# Altium schematic sheet out_role.SchDoc
size A0
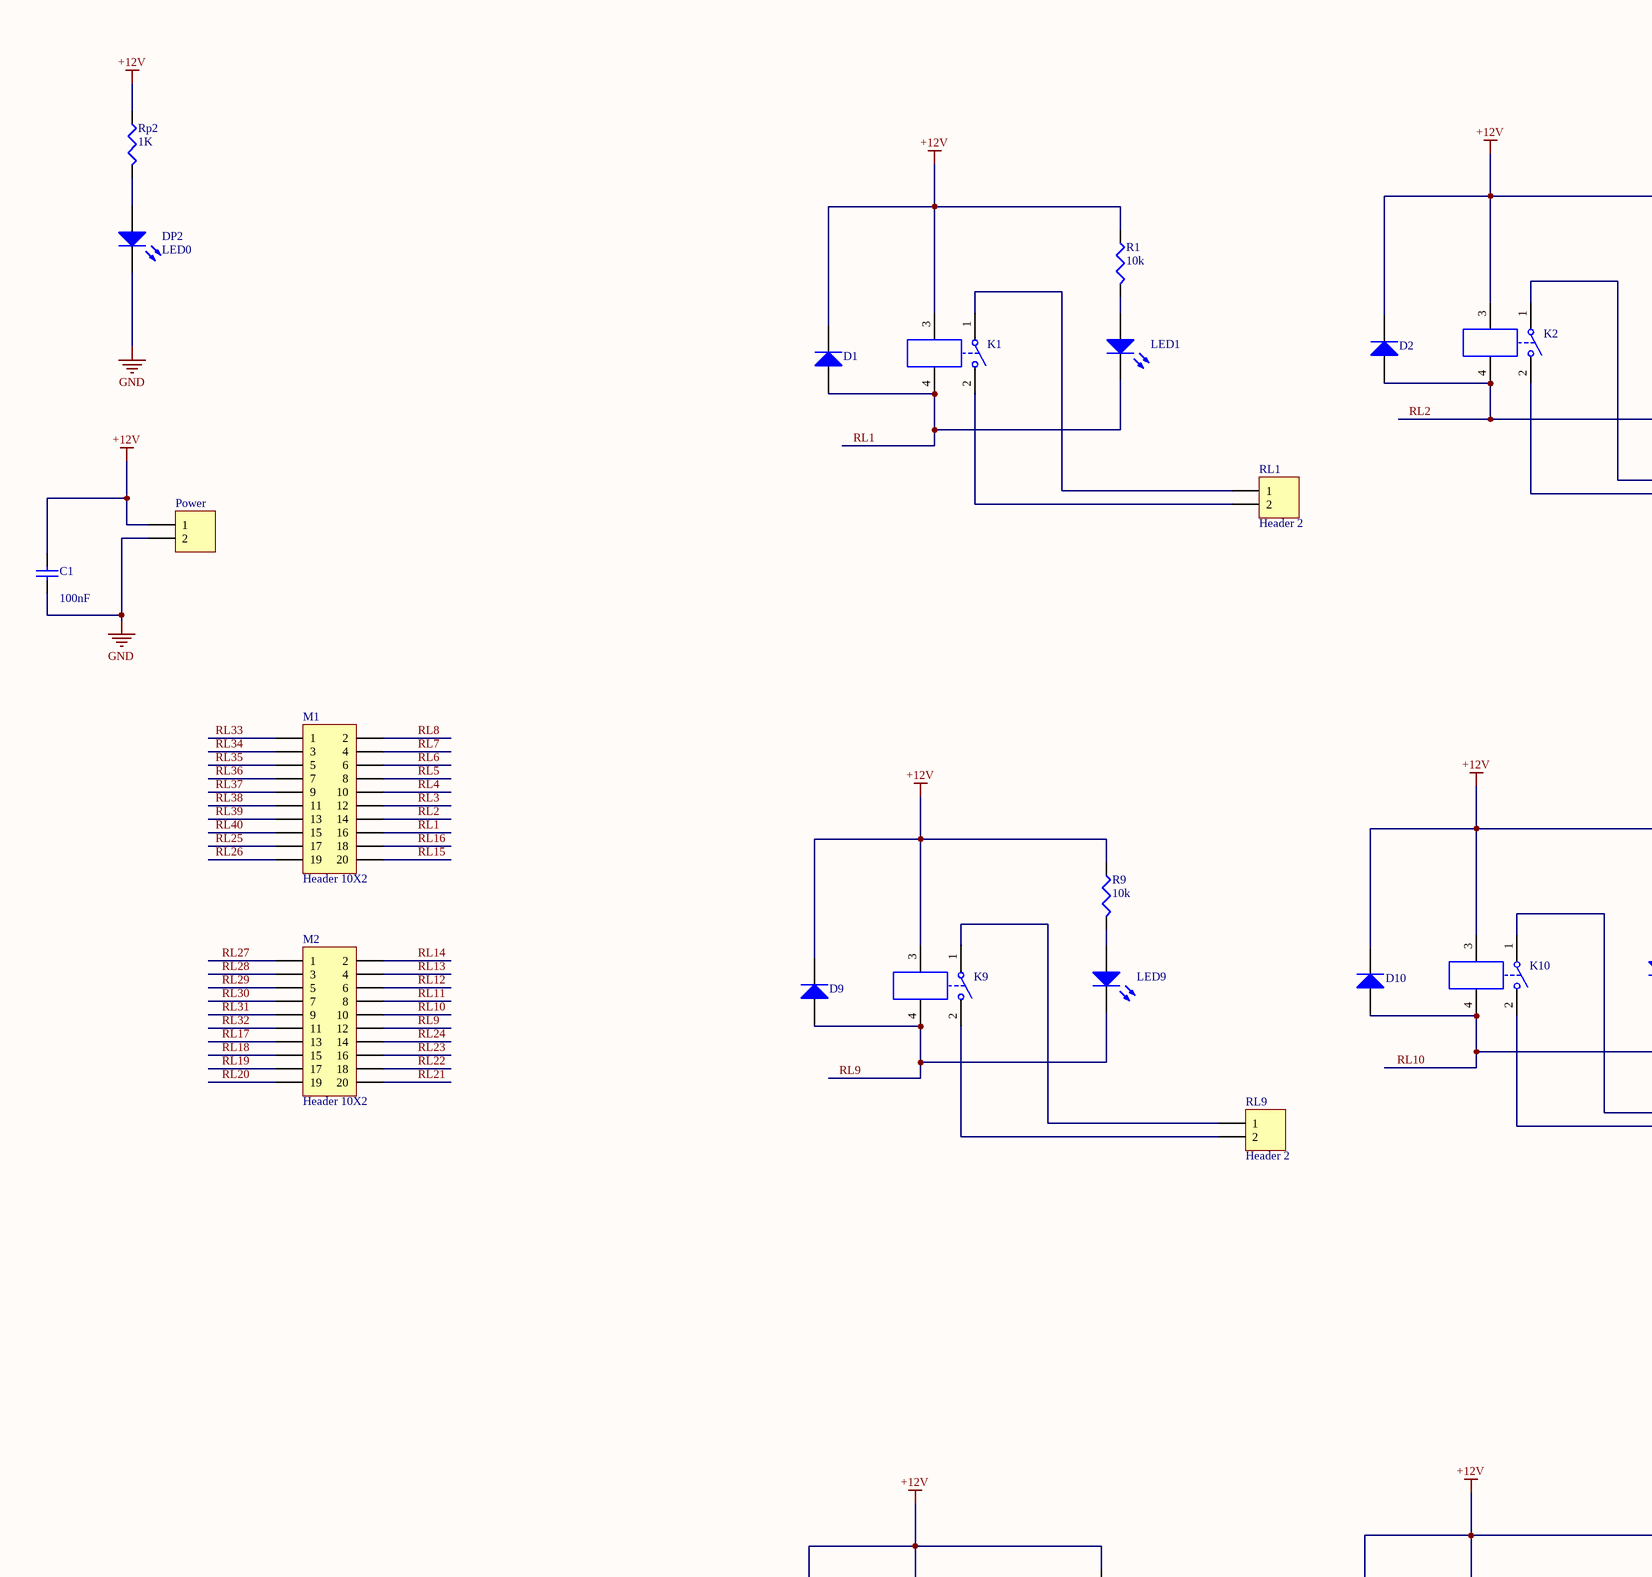
[diagram p0: out_role.SchDoc, top left]
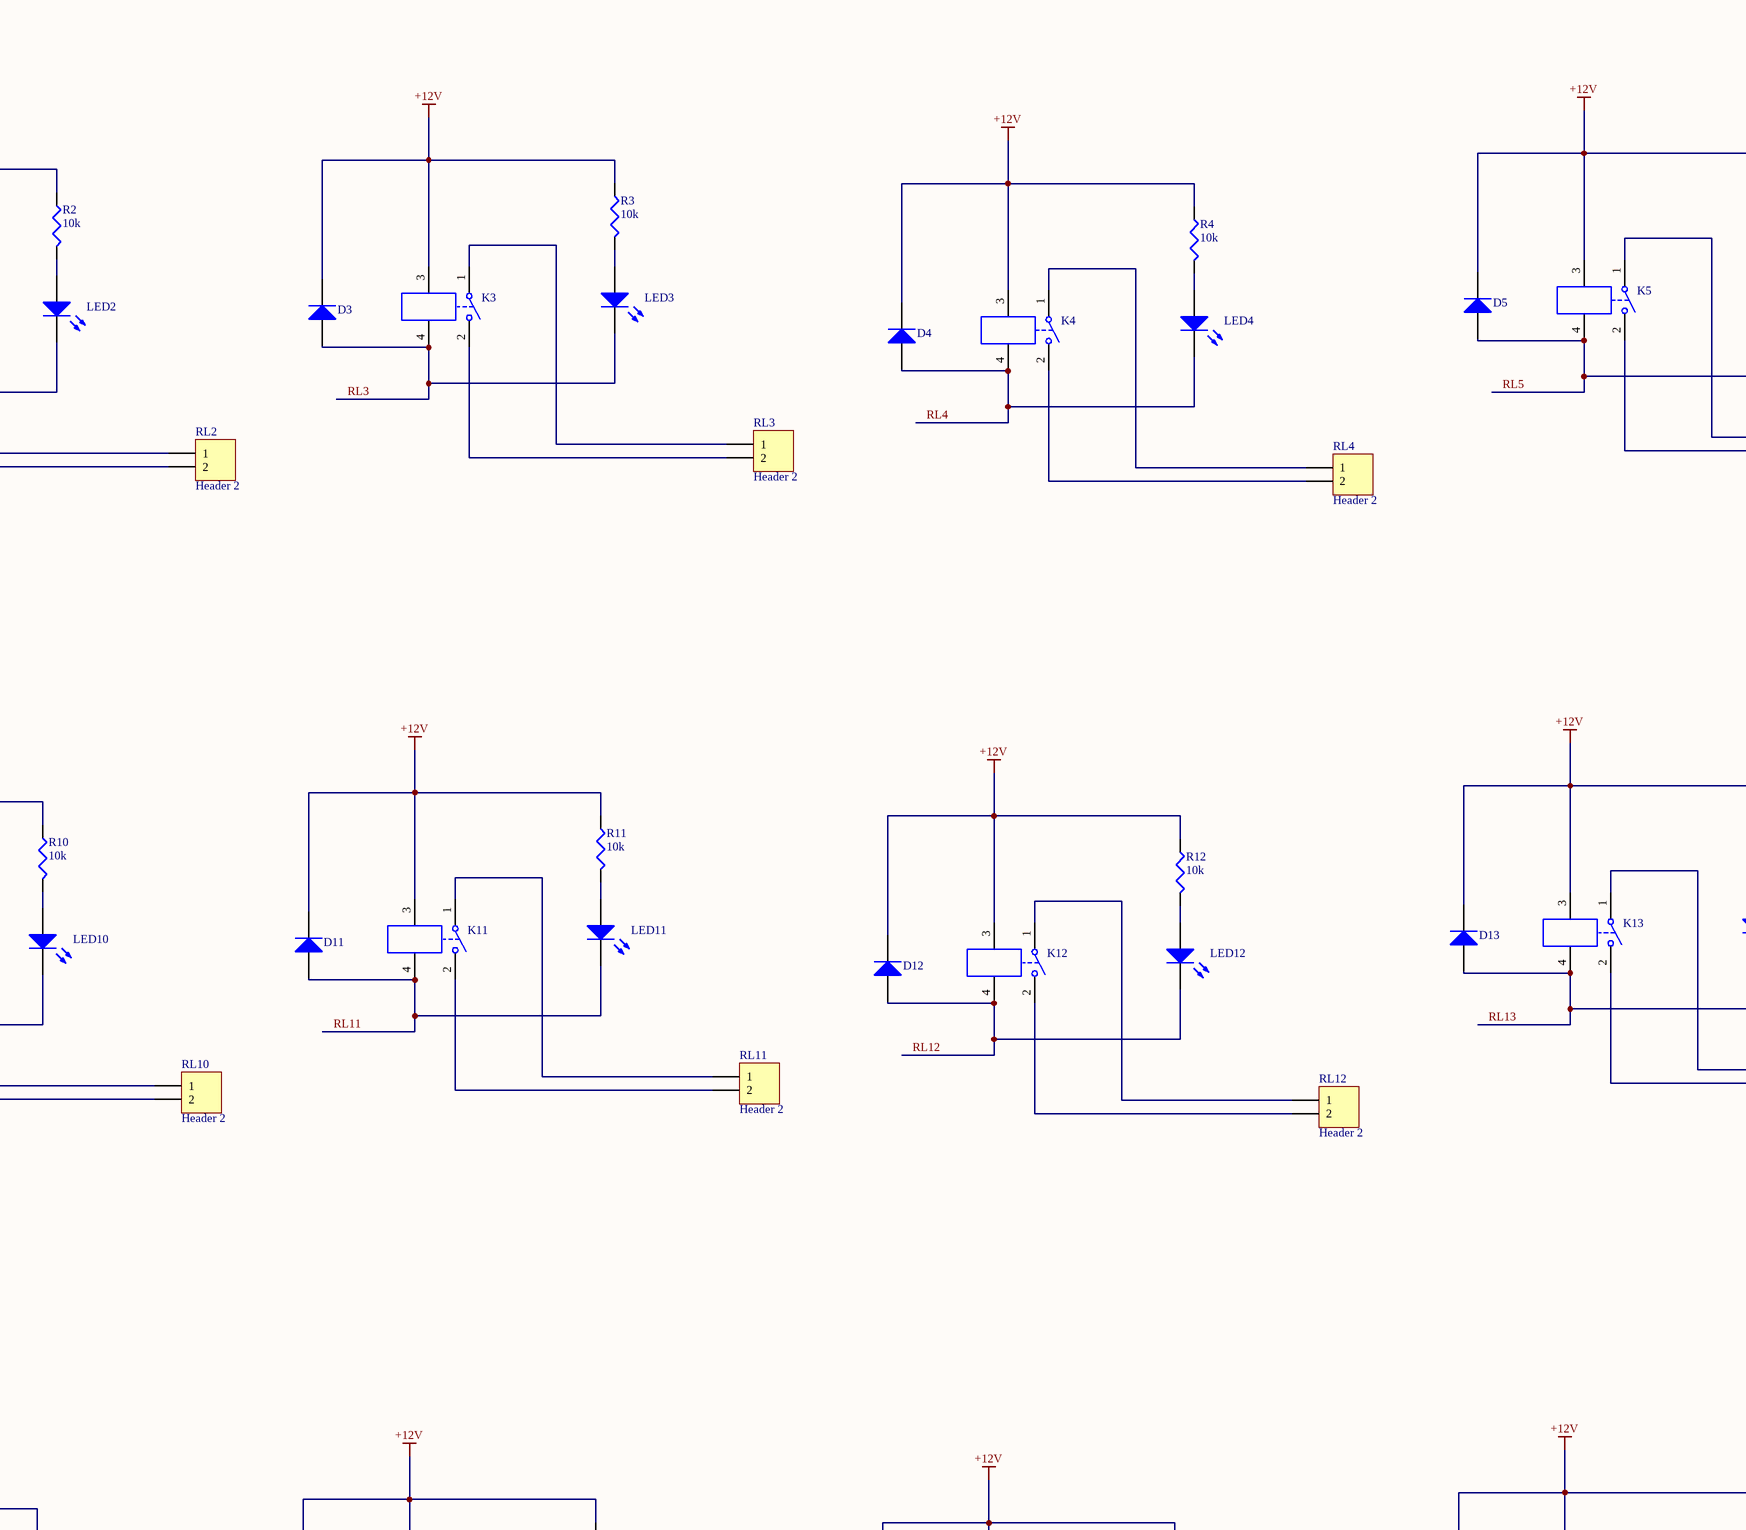
[diagram p1: out_role.SchDoc, top middle]
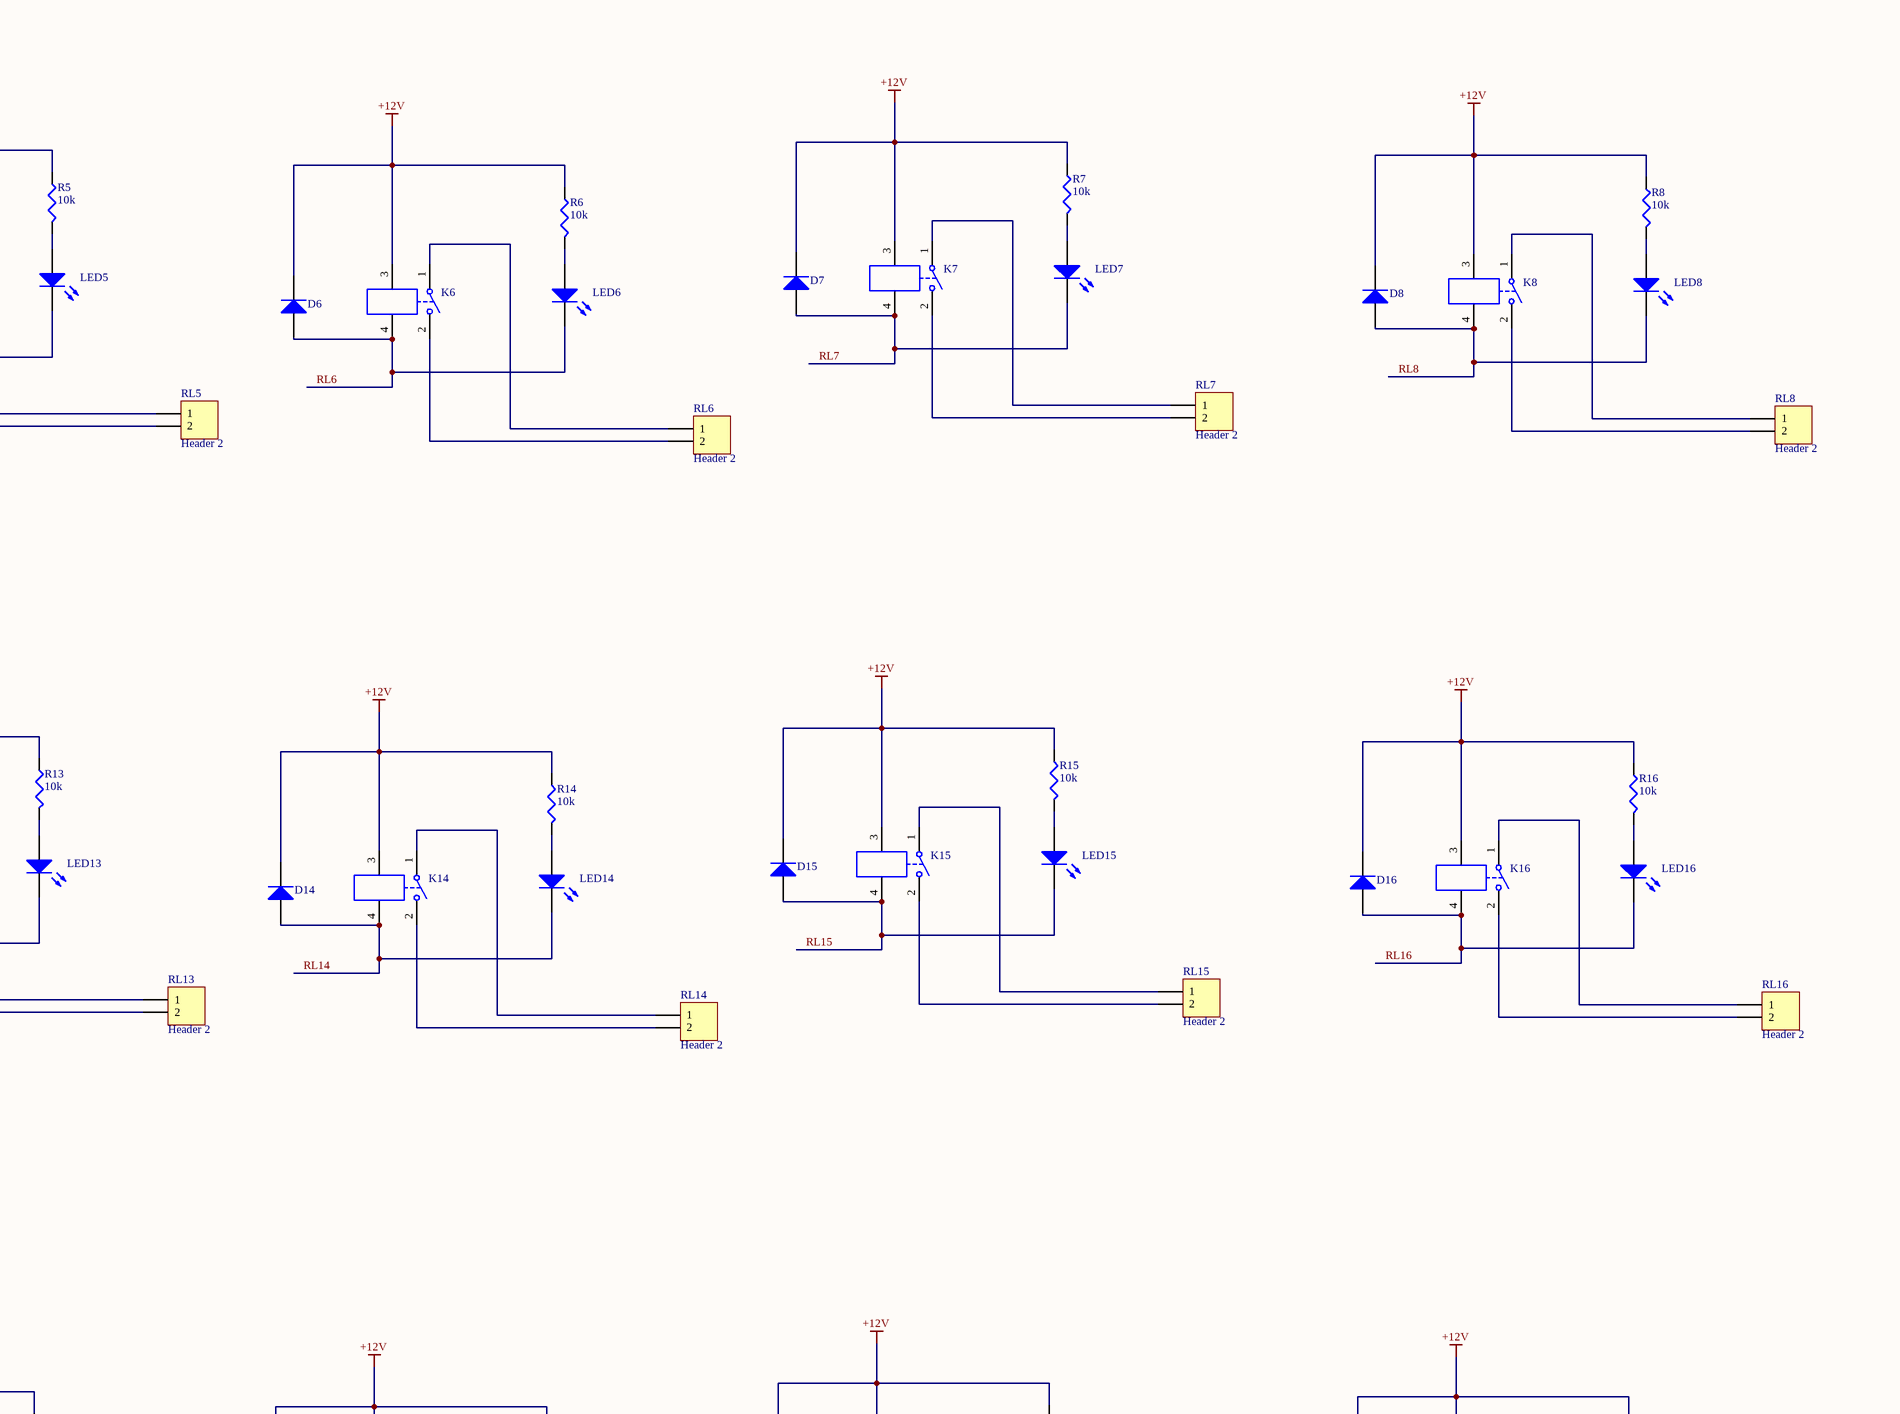
[diagram p2: out_role.SchDoc, top right]
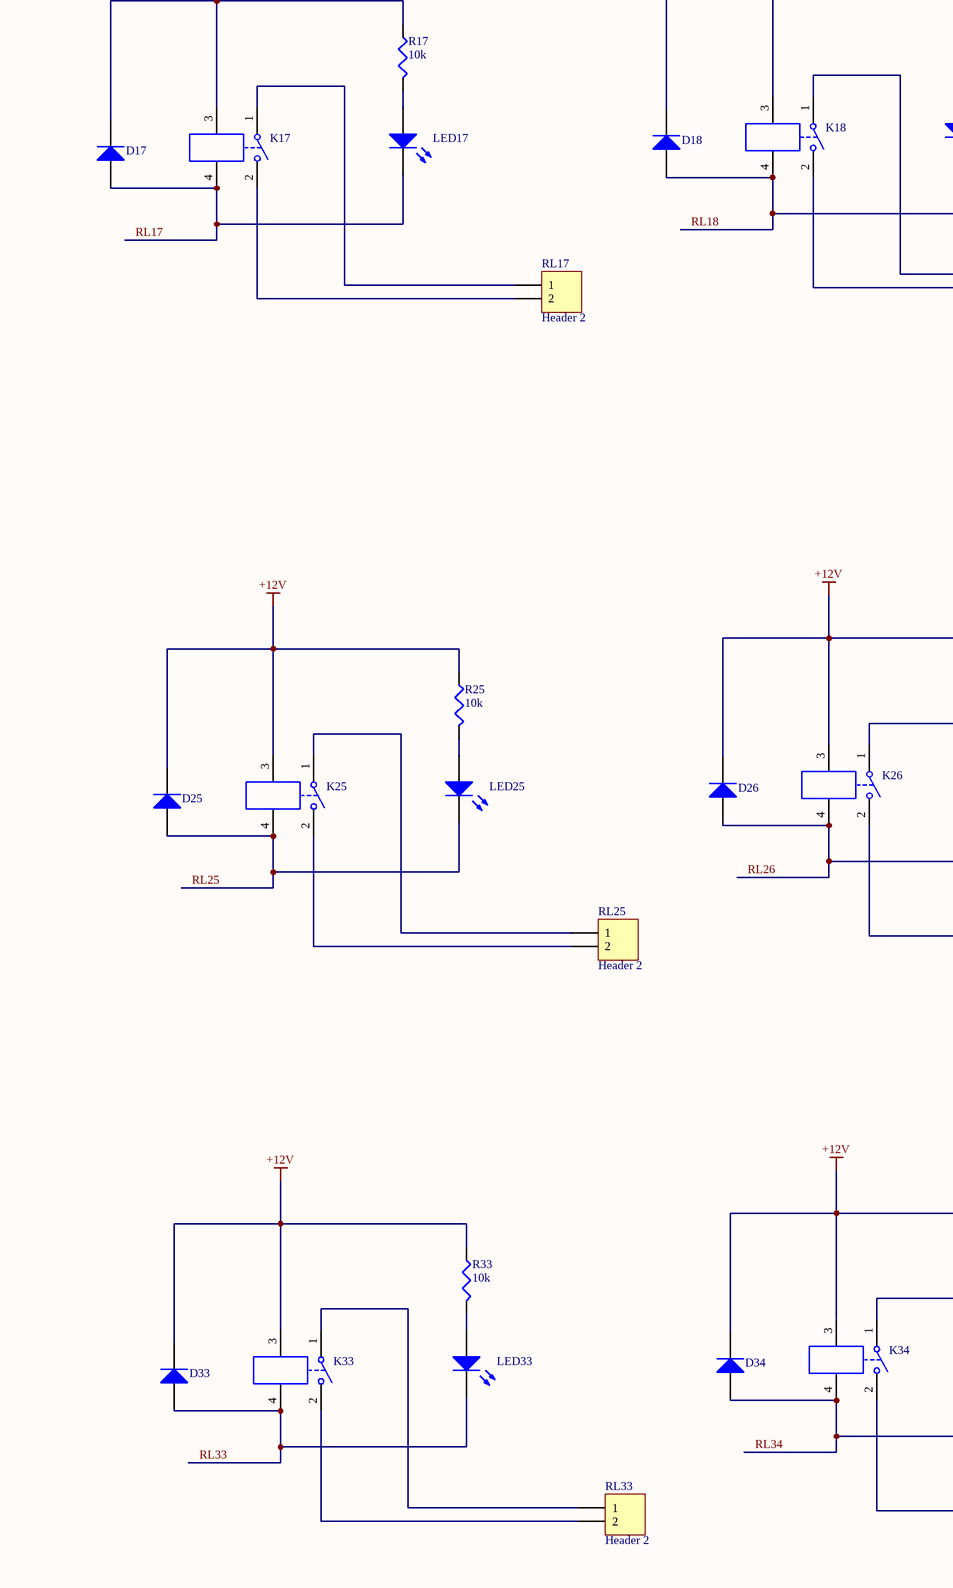
[diagram p3: out_role.SchDoc, bottom left]
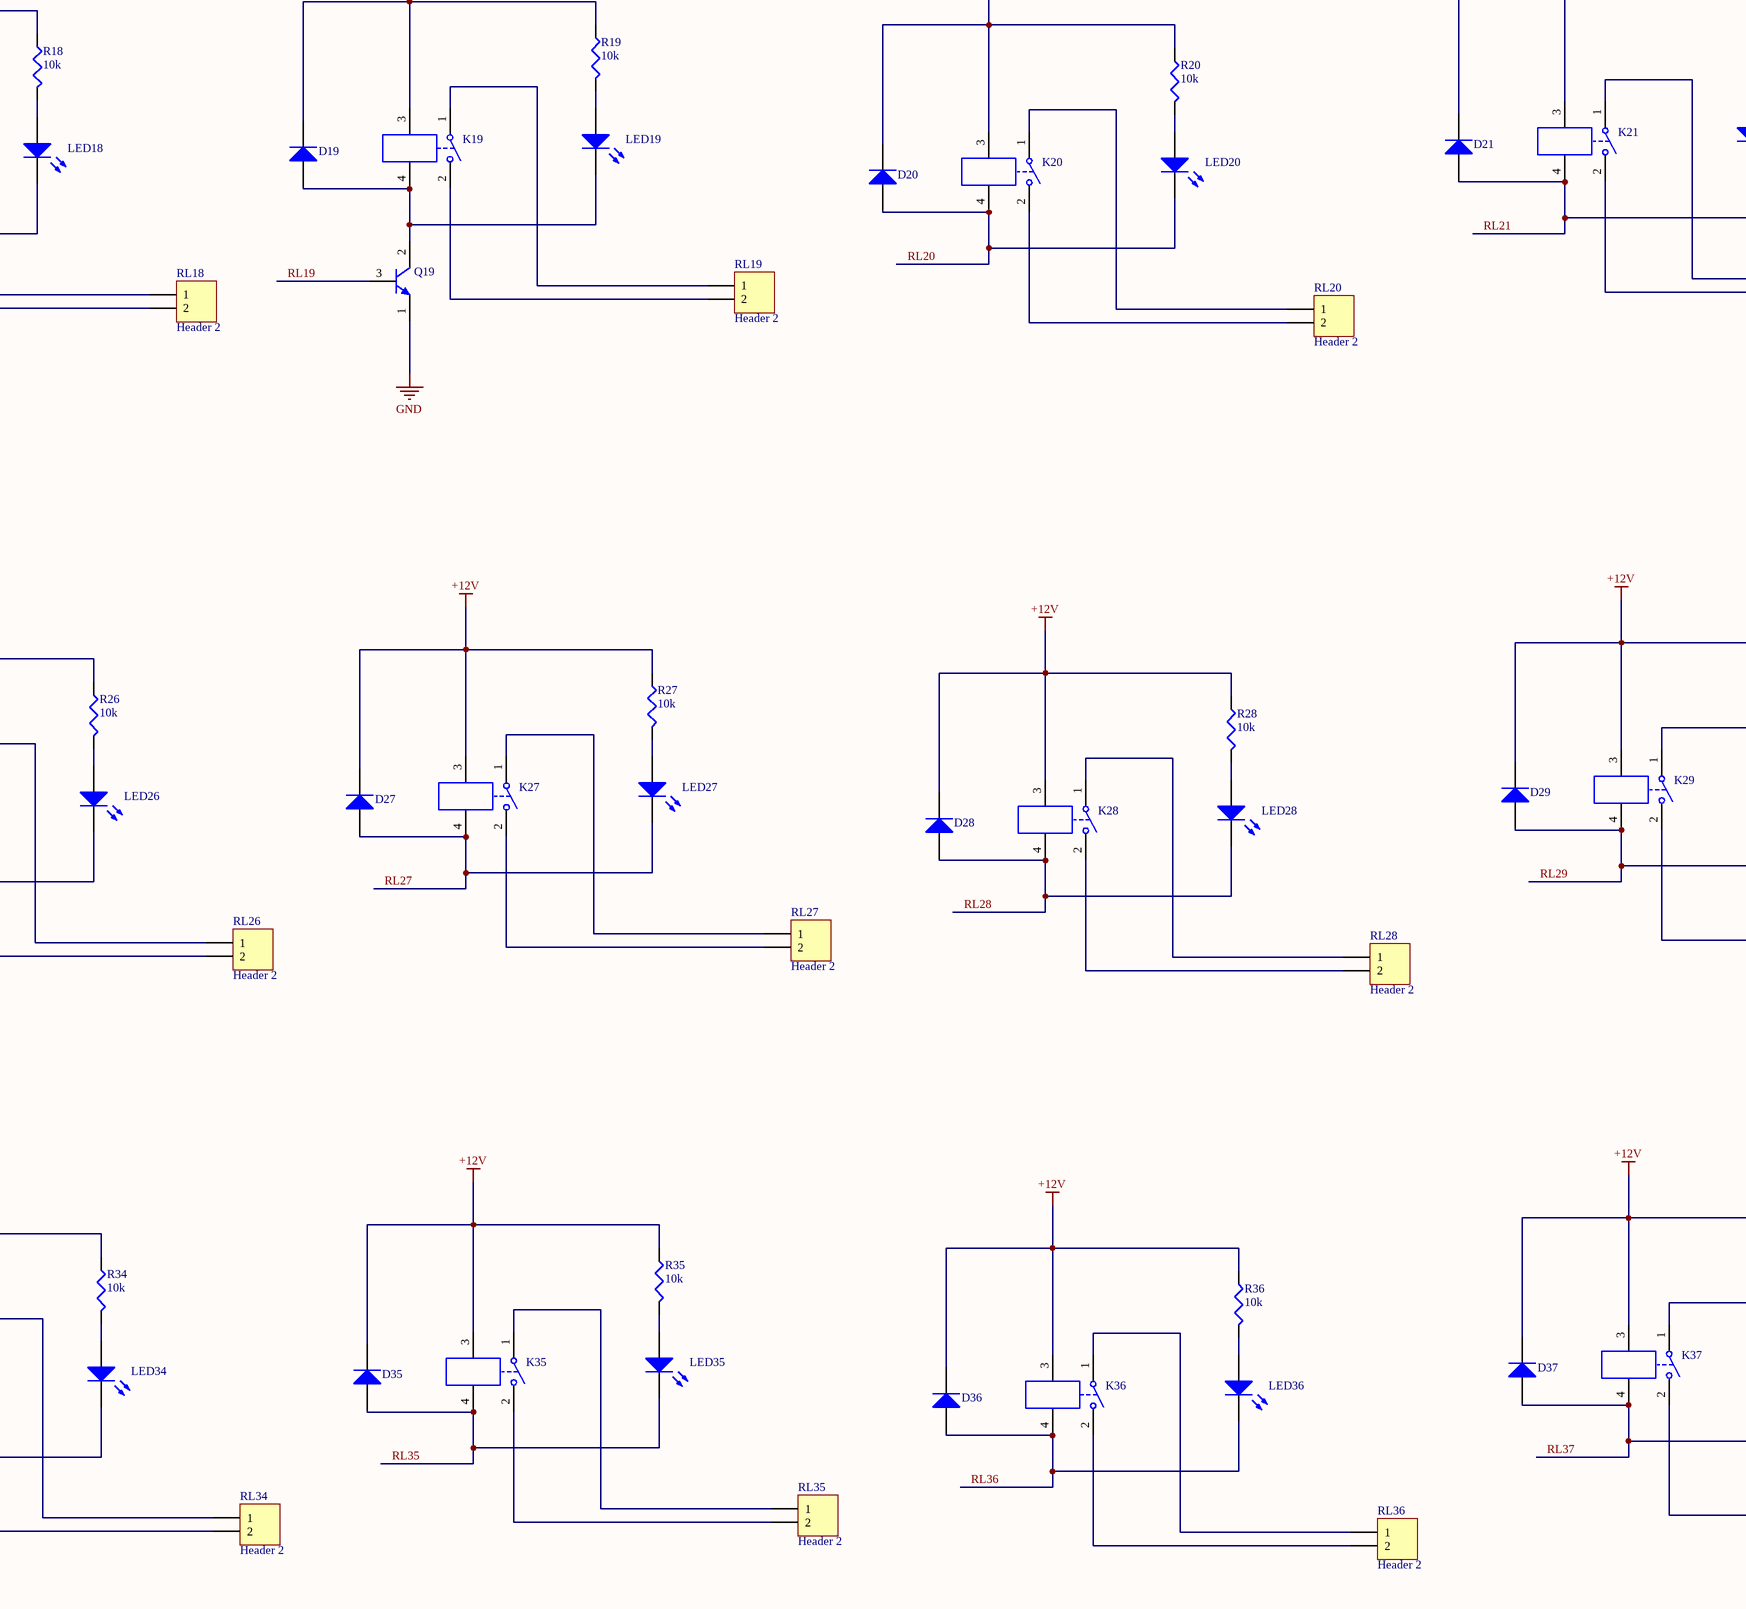
[diagram p4: out_role.SchDoc, bottom middle]
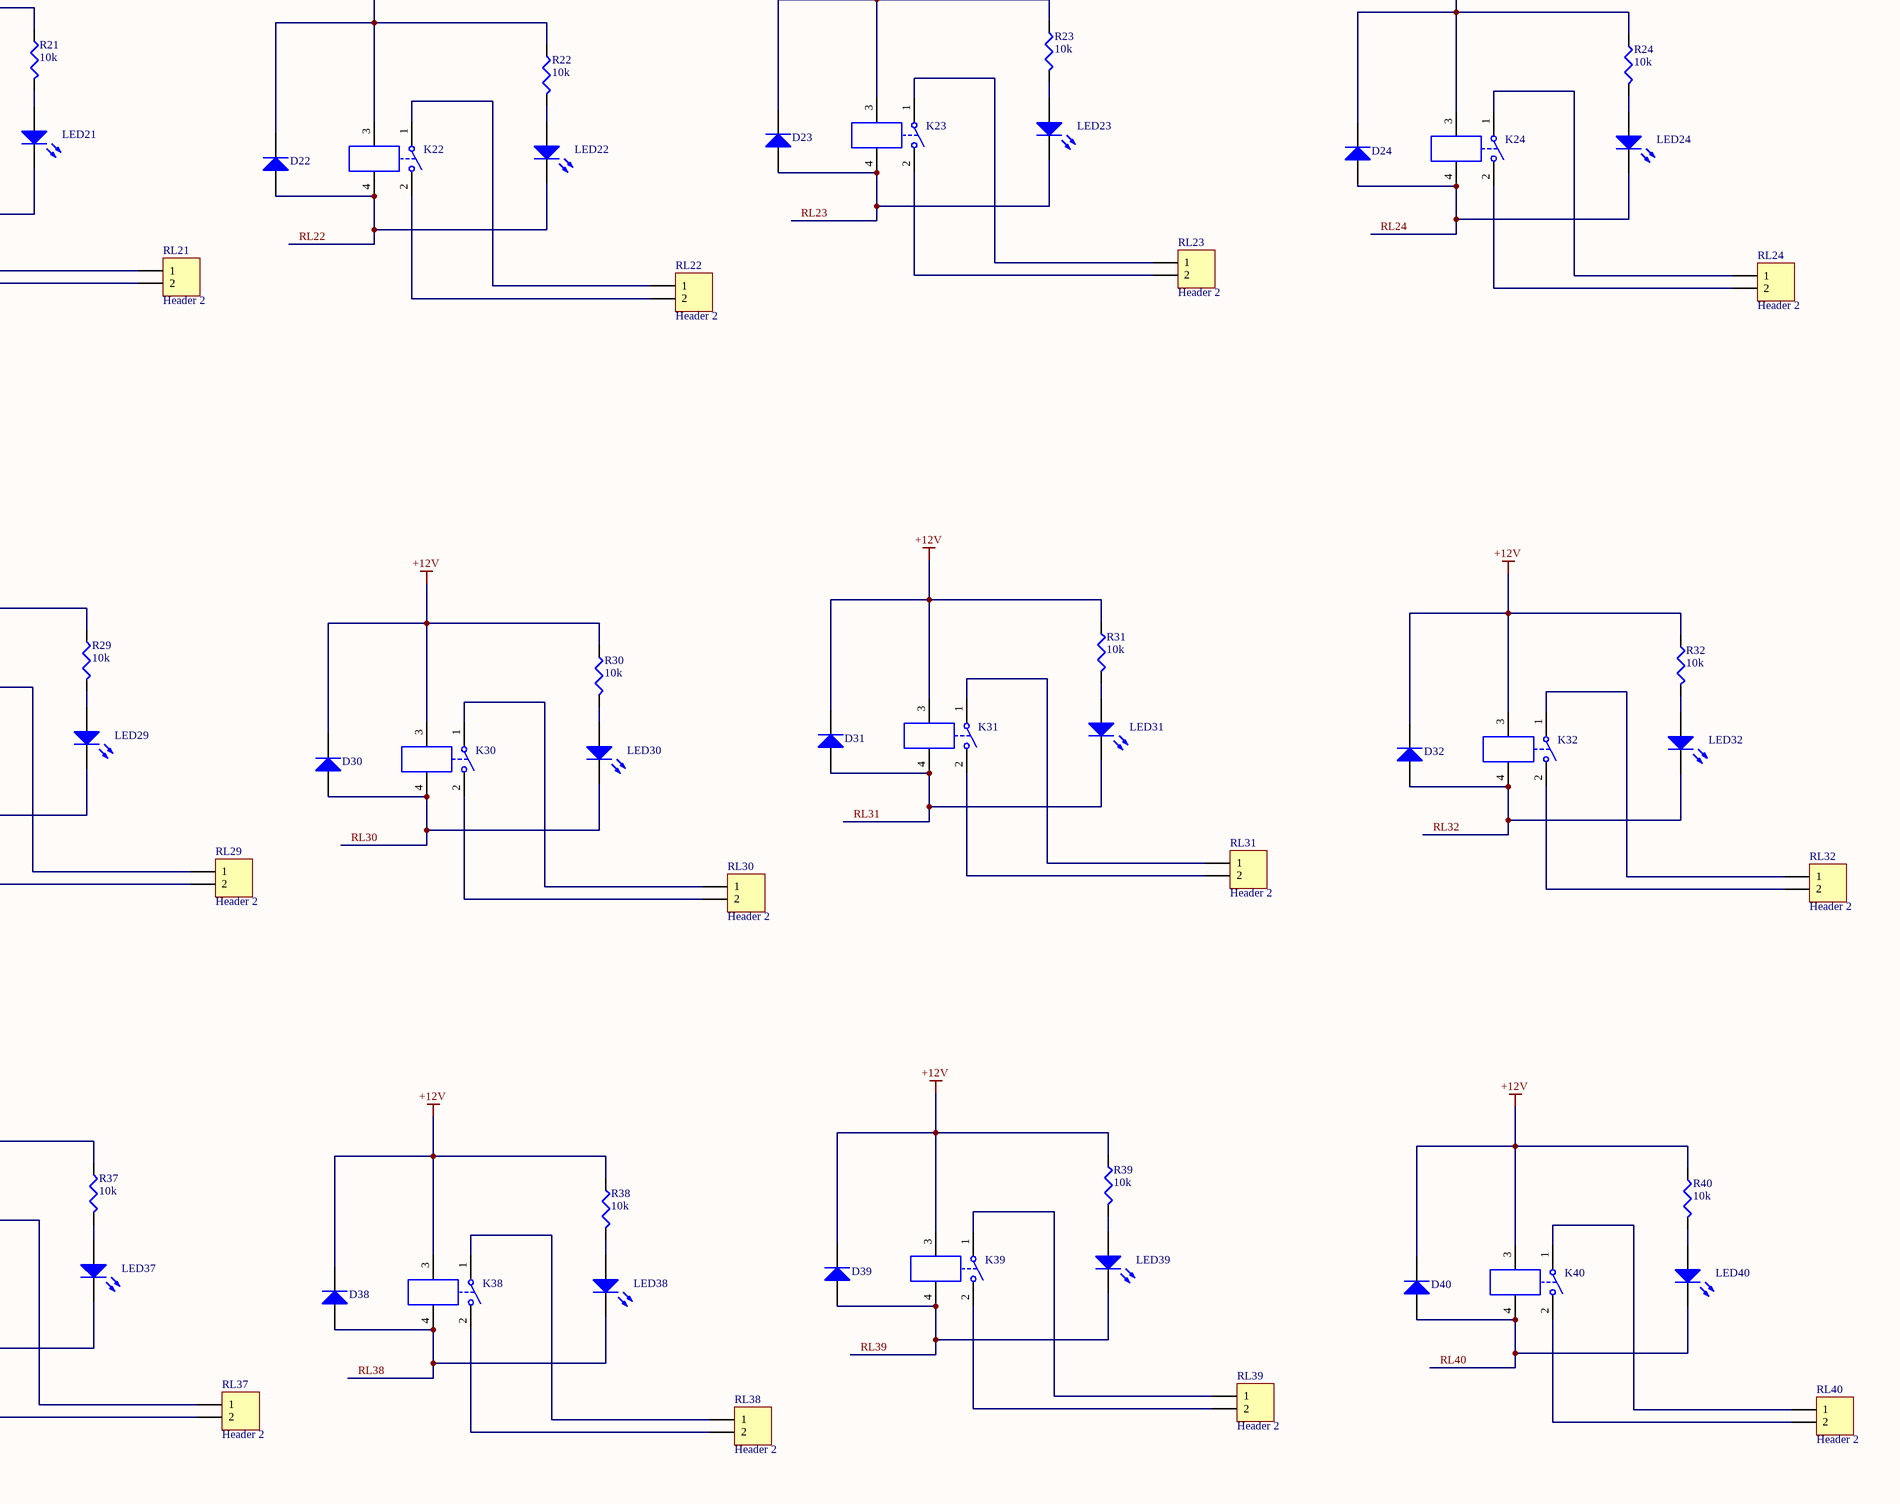
[diagram p5: out_role.SchDoc, bottom right]

## Parts
C1  value 100nF  [tu_gom]  (hidden comment: Cap)
D1  Diode  [D_1A]  (value not drawn)
D2  Diode  [D_1A]  (value not drawn)
D3  Diode  [D_1A]  (value not drawn)
D4  Diode  [D_1A]  (value not drawn)
D5  Diode  [D_1A]  (value not drawn)
D6  Diode  [D_1A]  (value not drawn)
D7  Diode  [D_1A]  (value not drawn)
D8  Diode  [D_1A]  (value not drawn)
D9  Diode  [D_1A]  (value not drawn)
D10  Diode  [D_1A]  (value not drawn)
D11  Diode  [D_1A]  (value not drawn)
D12  Diode  [D_1A]  (value not drawn)
D13  Diode  [D_1A]  (value not drawn)
D14  Diode  [D_1A]  (value not drawn)
D15  Diode  [D_1A]  (value not drawn)
D16  Diode  [D_1A]  (value not drawn)
D17  Diode  [D_1A]  (value not drawn)
D18  Diode  [D_1A]  (value not drawn)
D19  Diode  [D_1A]  (value not drawn)
D20  Diode  [D_1A]  (value not drawn)
D21  Diode  [D_1A]  (value not drawn)
D22  Diode  [D_1A]  (value not drawn)
D23  Diode  [D_1A]  (value not drawn)
D24  Diode  [D_1A]  (value not drawn)
D25  Diode  [D_1A]  (value not drawn)
D26  Diode  [D_1A]  (value not drawn)
D27  Diode  [D_1A]  (value not drawn)
D28  Diode  [D_1A]  (value not drawn)
D29  Diode  [D_1A]  (value not drawn)
D30  Diode  [D_1A]  (value not drawn)
D31  Diode  [D_1A]  (value not drawn)
D32  Diode  [D_1A]  (value not drawn)
D33  Diode  [D_1A]  (value not drawn)
D34  Diode  [D_1A]  (value not drawn)
D35  Diode  [D_1A]  (value not drawn)
D36  Diode  [D_1A]  (value not drawn)
D37  Diode  [D_1A]  (value not drawn)
D38  Diode  [D_1A]  (value not drawn)
D39  Diode  [D_1A]  (value not drawn)
D40  Diode  [D_1A]  (value not drawn)
DP2  LED0  [LED_3]
K1  Relay-SPST  [ROLE12V_JP]  (value not drawn)
K2  Relay-SPST  [ROLE12V_JP]  (value not drawn)
K3  Relay-SPST  [ROLE12V_JP]  (value not drawn)
K4  Relay-SPST  [ROLE12V_JP]  (value not drawn)
K5  Relay-SPST  [ROLE12V_JP]  (value not drawn)
K6  Relay-SPST  [ROLE12V_JP]  (value not drawn)
K7  Relay-SPST  [ROLE12V_JP]  (value not drawn)
K8  Relay-SPST  [ROLE12V_JP]  (value not drawn)
K9  Relay-SPST  [ROLE12V_JP]  (value not drawn)
K10  Relay-SPST  [ROLE12V_JP]  (value not drawn)
K11  Relay-SPST  [ROLE12V_JP]  (value not drawn)
K12  Relay-SPST  [ROLE12V_JP]  (value not drawn)
K13  Relay-SPST  [ROLE12V_JP]  (value not drawn)
K14  Relay-SPST  [ROLE12V_JP]  (value not drawn)
K15  Relay-SPST  [ROLE12V_JP]  (value not drawn)
K16  Relay-SPST  [ROLE12V_JP]  (value not drawn)
K17  Relay-SPST  [ROLE12V_JP]  (value not drawn)
K18  Relay-SPST  [ROLE12V_JP]  (value not drawn)
K19  Relay-SPST  [ROLE12V_JP]  (value not drawn)
K20  Relay-SPST  [ROLE12V_JP]  (value not drawn)
K21  Relay-SPST  [ROLE12V_JP]  (value not drawn)
K22  Relay-SPST  [ROLE12V_JP]  (value not drawn)
K23  Relay-SPST  [ROLE12V_JP]  (value not drawn)
K24  Relay-SPST  [ROLE12V_JP]  (value not drawn)
K25  Relay-SPST  [ROLE12V_JP]  (value not drawn)
K26  Relay-SPST  [ROLE12V_JP]  (value not drawn)
K27  Relay-SPST  [ROLE12V_JP]  (value not drawn)
K28  Relay-SPST  [ROLE12V_JP]  (value not drawn)
K29  Relay-SPST  [ROLE12V_JP]  (value not drawn)
K30  Relay-SPST  [ROLE12V_JP]  (value not drawn)
K31  Relay-SPST  [ROLE12V_JP]  (value not drawn)
K32  Relay-SPST  [ROLE12V_JP]  (value not drawn)
K33  Relay-SPST  [ROLE12V_JP]  (value not drawn)
K34  Relay-SPST  [ROLE12V_JP]  (value not drawn)
K35  Relay-SPST  [ROLE12V_JP]  (value not drawn)
K36  Relay-SPST  [ROLE12V_JP]  (value not drawn)
K37  Relay-SPST  [ROLE12V_JP]  (value not drawn)
K38  Relay-SPST  [ROLE12V_JP]  (value not drawn)
K39  Relay-SPST  [ROLE12V_JP]  (value not drawn)
K40  Relay-SPST  [ROLE12V_JP]  (value not drawn)
LED1  LED0  [LED_3]  (value not drawn)
LED2  LED0  [LED_3]  (value not drawn)
LED3  LED0  [LED_3]  (value not drawn)
LED4  LED0  [LED_3]  (value not drawn)
LED5  LED0  [LED_3]  (value not drawn)
LED6  LED0  [LED_3]  (value not drawn)
LED7  LED0  [LED_3]  (value not drawn)
LED8  LED0  [LED_3]  (value not drawn)
LED9  LED0  [LED_3]  (value not drawn)
LED10  LED0  [LED_3]  (value not drawn)
LED11  LED0  [LED_3]  (value not drawn)
LED12  LED0  [LED_3]  (value not drawn)
LED13  LED0  [LED_3]  (value not drawn)
LED14  LED0  [LED_3]  (value not drawn)
LED15  LED0  [LED_3]  (value not drawn)
LED16  LED0  [LED_3]  (value not drawn)
LED17  LED0  [LED_3]  (value not drawn)
LED18  LED0  [LED_3]  (value not drawn)
LED19  LED0  [LED_3]  (value not drawn)
LED20  LED0  [LED_3]  (value not drawn)
LED21  LED0  [LED_3]  (value not drawn)
LED22  LED0  [LED_3]  (value not drawn)
LED23  LED0  [LED_3]  (value not drawn)
LED24  LED0  [LED_3]  (value not drawn)
LED25  LED0  [LED_3]  (value not drawn)
LED26  LED0  [LED_3]  (value not drawn)
LED27  LED0  [LED_3]  (value not drawn)
LED28  LED0  [LED_3]  (value not drawn)
LED29  LED0  [LED_3]  (value not drawn)
LED30  LED0  [LED_3]  (value not drawn)
LED31  LED0  [LED_3]  (value not drawn)
LED32  LED0  [LED_3]  (value not drawn)
LED33  LED0  [LED_3]  (value not drawn)
LED34  LED0  [LED_3]  (value not drawn)
LED35  LED0  [LED_3]  (value not drawn)
LED36  LED0  [LED_3]  (value not drawn)
LED37  LED0  [LED_3]  (value not drawn)
LED38  LED0  [LED_3]  (value not drawn)
LED39  LED0  [LED_3]  (value not drawn)
LED40  LED0  [LED_3]  (value not drawn)
M1  Header 10X2  [HDR2X10]
M2  Header 10X2  [HDR2X10]
Power  Header 2  [Header_nguon_20A]  (value not drawn)
Q19  2N3904  [D468/A1013]  (value not drawn)
R1  value 10k  [R_Nor]  (hidden comment: Res3)
R2  value 10k  [R_Nor]  (hidden comment: Res3)
R3  value 10k  [R_Nor]  (hidden comment: Res3)
R4  value 10k  [R_Nor]  (hidden comment: Res3)
R5  value 10k  [R_Nor]  (hidden comment: Res3)
R6  value 10k  [R_Nor]  (hidden comment: Res3)
R7  value 10k  [R_Nor]  (hidden comment: Res3)
R8  value 10k  [R_Nor]  (hidden comment: Res3)
R9  value 10k  [R_Nor]  (hidden comment: Res3)
R10  value 10k  [R_Nor]  (hidden comment: Res3)
R11  value 10k  [R_Nor]  (hidden comment: Res3)
R12  value 10k  [R_Nor]  (hidden comment: Res3)
R13  value 10k  [R_Nor]  (hidden comment: Res3)
R14  value 10k  [R_Nor]  (hidden comment: Res3)
R15  value 10k  [R_Nor]  (hidden comment: Res3)
R16  value 10k  [R_Nor]  (hidden comment: Res3)
R17  value 10k  [R_Nor]  (hidden comment: Res3)
R18  value 10k  [R_Nor]  (hidden comment: Res3)
R19  value 10k  [R_Nor]  (hidden comment: Res3)
R20  value 10k  [R_Nor]  (hidden comment: Res3)
R21  value 10k  [R_Nor]  (hidden comment: Res3)
R22  value 10k  [R_Nor]  (hidden comment: Res3)
R23  value 10k  [R_Nor]  (hidden comment: Res3)
R24  value 10k  [R_Nor]  (hidden comment: Res3)
R25  value 10k  [R_Nor]  (hidden comment: Res3)
R26  value 10k  [R_Nor]  (hidden comment: Res3)
R27  value 10k  [R_Nor]  (hidden comment: Res3)
R28  value 10k  [R_Nor]  (hidden comment: Res3)
R29  value 10k  [R_Nor]  (hidden comment: Res3)
R30  value 10k  [R_Nor]  (hidden comment: Res3)
R31  value 10k  [R_Nor]  (hidden comment: Res3)
R32  value 10k  [R_Nor]  (hidden comment: Res3)
R33  value 10k  [R_Nor]  (hidden comment: Res3)
R34  value 10k  [R_Nor]  (hidden comment: Res3)
R35  value 10k  [R_Nor]  (hidden comment: Res3)
R36  value 10k  [R_Nor]  (hidden comment: Res3)
R37  value 10k  [R_Nor]  (hidden comment: Res3)
R38  value 10k  [R_Nor]  (hidden comment: Res3)
R39  value 10k  [R_Nor]  (hidden comment: Res3)
R40  value 10k  [R_Nor]  (hidden comment: Res3)
RL1  Header 2  [Header_nguon_20A]
RL2  Header 2  [Header_nguon_20A]
RL3  Header 2  [Header_nguon_20A]
RL4  Header 2  [Header_nguon_20A]
RL5  Header 2  [Header_nguon_20A]
RL6  Header 2  [Header_nguon_20A]
RL7  Header 2  [Header_nguon_20A]
RL8  Header 2  [Header_nguon_20A]
RL9  Header 2  [Header_nguon_20A]
RL10  Header 2  [Header_nguon_20A]
RL11  Header 2  [Header_nguon_20A]
RL12  Header 2  [Header_nguon_20A]
RL13  Header 2  [Header_nguon_20A]
RL14  Header 2  [Header_nguon_20A]
RL15  Header 2  [Header_nguon_20A]
RL16  Header 2  [Header_nguon_20A]
RL17  Header 2  [Header_nguon_20A]
RL18  Header 2  [Header_nguon_20A]
RL19  Header 2  [Header_nguon_20A]
RL20  Header 2  [Header_nguon_20A]
RL21  Header 2  [Header_nguon_20A]
RL22  Header 2  [Header_nguon_20A]
RL23  Header 2  [Header_nguon_20A]
RL24  Header 2  [Header_nguon_20A]
RL25  Header 2  [Header_nguon_20A]
RL26  Header 2  [Header_nguon_20A]
RL27  Header 2  [Header_nguon_20A]
RL28  Header 2  [Header_nguon_20A]
RL29  Header 2  [Header_nguon_20A]
RL30  Header 2  [Header_nguon_20A]
RL31  Header 2  [Header_nguon_20A]
RL32  Header 2  [Header_nguon_20A]
RL33  Header 2  [Header_nguon_20A]
RL34  Header 2  [Header_nguon_20A]
RL35  Header 2  [Header_nguon_20A]
RL36  Header 2  [Header_nguon_20A]
RL37  Header 2  [Header_nguon_20A]
RL38  Header 2  [Header_nguon_20A]
RL39  Header 2  [Header_nguon_20A]
RL40  Header 2  [Header_nguon_20A]
Rp2  value 1K  [R_Nor]  (hidden comment: Res3)

## Nets
+12V: C1.1 D1.2(K) D2.2(K) D3.2(K) D4.2(K) D5.2(K) D6.2(K) D7.2(K) D8.2(K) D9.2(K) D10.2(K) D11.2(K) D12.2(K) D13.2(K) D14.2(K) D15.2(K) D16.2(K) D17.2(K) D18.2(K) D19.2(K) D20.2(K) D21.2(K) D22.2(K) D23.2(K) D24.2(K) D25.2(K) D26.2(K) D27.2(K) D28.2(K) D29.2(K) D30.2(K) D31.2(K) D32.2(K) D33.2(K) D34.2(K) D35.2(K) D36.2(K) D37.2(K) D38.2(K) D39.2(K) D40.2(K) K1.3 K2.3 K3.3 K4.3 K5.3 K6.3 K7.3 K8.3 K9.3 K10.3 K11.3 K12.3 K13.3 K14.3 K15.3 K16.3 K17.3 K18.3 K19.3 K20.3 K21.3 K22.3 K23.3 K24.3 K25.3 K26.3 K27.3 K28.3 K29.3 K30.3 K31.3 K32.3 K33.3 K34.3 K35.3 K36.3 K37.3 K38.3 K39.3 K40.3 Power.1 R1.1 R2.1 R3.1 R4.1 R5.1 R6.1 R7.1 R8.1 R9.1 R10.1 R11.1 R12.1 R13.1 R14.1 R15.1 R16.1 R17.1 R18.1 R19.1 R20.1 R21.1 R22.1 R23.1 R24.1 R25.1 R26.1 R27.1 R28.1 R29.1 R30.1 R31.1 R32.1 R33.1 R34.1 R35.1 R36.1 R37.1 R38.1 R39.1 R40.1 Rp2.1
GND: C1.2 DP2.2(K) Power.2 Q19.1(E)
RL1: D1.1(A) K1.4 LED1.2(K) M1.16
RL2: D2.1(A) K2.4 LED2.2(K) M1.14
RL3: D3.1(A) K3.4 LED3.2(K) M1.12
RL4: D4.1(A) K4.4 LED4.2(K) M1.10
RL5: D5.1(A) K5.4 LED5.2(K) M1.8
RL6: D6.1(A) K6.4 LED6.2(K) M1.6
RL7: D7.1(A) K7.4 LED7.2(K) M1.4
RL8: D8.1(A) K8.4 LED8.2(K) M1.2
RL9: D9.1(A) K9.4 LED9.2(K) M2.12
RL10: D10.1(A) K10.4 LED10.2(K) M2.10
RL11: D11.1(A) K11.4 LED11.2(K) M2.8
RL12: D12.1(A) K12.4 LED12.2(K) M2.6
RL13: D13.1(A) K13.4 LED13.2(K) M2.4
RL14: D14.1(A) K14.4 LED14.2(K) M2.2
RL15: D15.1(A) K15.4 LED15.2(K) M1.20
RL16: D16.1(A) K16.4 LED16.2(K) M1.18
RL17: D17.1(A) K17.4 LED17.2(K) M2.13
RL18: D18.1(A) K18.4 LED18.2(K) M2.15
RL19: M2.17 Q19.3(B)
RL20: D20.1(A) K20.4 LED20.2(K) M2.19
RL21: D21.1(A) K21.4 LED21.2(K) M2.20
RL22: D22.1(A) K22.4 LED22.2(K) M2.18
RL23: D23.1(A) K23.4 LED23.2(K) M2.16
RL24: D24.1(A) K24.4 LED24.2(K) M2.14
RL25: D25.1(A) K25.4 LED25.2(K) M1.17
RL26: D26.1(A) K26.4 LED26.2(K) M1.19
RL27: D27.1(A) K27.4 LED27.2(K) M2.1
RL28: D28.1(A) K28.4 LED28.2(K) M2.3
RL29: D29.1(A) K29.4 LED29.2(K) M2.5
RL30: D30.1(A) K30.4 LED30.2(K) M2.7
RL31: D31.1(A) K31.4 LED31.2(K) M2.9
RL32: D32.1(A) K32.4 LED32.2(K) M2.11
RL33: D33.1(A) K33.4 LED33.2(K) M1.1
RL34: D34.1(A) K34.4 LED34.2(K) M1.3
RL35: D35.1(A) K35.4 LED35.2(K) M1.5
RL36: D36.1(A) K36.4 LED36.2(K) M1.7
RL37: D37.1(A) K37.4 LED37.2(K) M1.9
RL38: D38.1(A) K38.4 LED38.2(K) M1.11
RL39: D39.1(A) K39.4 LED39.2(K) M1.13
RL40: D40.1(A) K40.4 LED40.2(K) M1.15
NetD19_1: D19.1(A) K19.4 LED19.2(K) Q19.2(C)
NetDP2_1: DP2.1(A) Rp2.2
NetK1_1: K1.1 RL1.1
NetK1_2: K1.2 RL1.2
NetK2_1: K2.1 RL2.1
NetK2_2: K2.2 RL2.2
NetK3_1: K3.1 RL3.1
NetK3_2: K3.2 RL3.2
NetK4_1: K4.1 RL4.1
NetK4_2: K4.2 RL4.2
NetK5_1: K5.1 RL5.1
NetK5_2: K5.2 RL5.2
NetK6_1: K6.1 RL6.1
NetK6_2: K6.2 RL6.2
NetK7_1: K7.1 RL7.1
NetK7_2: K7.2 RL7.2
NetK8_1: K8.1 RL8.1
NetK8_2: K8.2 RL8.2
NetK9_1: K9.1 RL9.1
NetK9_2: K9.2 RL9.2
NetK10_1: K10.1 RL10.1
NetK10_2: K10.2 RL10.2
NetK11_1: K11.1 RL11.1
NetK11_2: K11.2 RL11.2
NetK12_1: K12.1 RL12.1
NetK12_2: K12.2 RL12.2
NetK13_1: K13.1 RL13.1
NetK13_2: K13.2 RL13.2
NetK14_1: K14.1 RL14.1
NetK14_2: K14.2 RL14.2
NetK15_1: K15.1 RL15.1
NetK15_2: K15.2 RL15.2
NetK16_1: K16.1 RL16.1
NetK16_2: K16.2 RL16.2
NetK17_1: K17.1 RL17.1
NetK17_2: K17.2 RL17.2
NetK18_1: K18.1 RL18.1
NetK18_2: K18.2 RL18.2
NetK19_1: K19.1 RL19.1
NetK19_2: K19.2 RL19.2
NetK20_1: K20.1 RL20.1
NetK20_2: K20.2 RL20.2
NetK21_1: K21.1 RL21.1
NetK21_2: K21.2 RL21.2
NetK22_1: K22.1 RL22.1
NetK22_2: K22.2 RL22.2
NetK23_1: K23.1 RL23.1
NetK23_2: K23.2 RL23.2
NetK24_1: K24.1 RL24.1
NetK24_2: K24.2 RL24.2
NetK25_1: K25.1 RL25.1
NetK25_2: K25.2 RL25.2
NetK26_1: K26.1 RL26.1
NetK26_2: K26.2 RL26.2
NetK27_1: K27.1 RL27.1
NetK27_2: K27.2 RL27.2
NetK28_1: K28.1 RL28.1
NetK28_2: K28.2 RL28.2
NetK29_1: K29.1 RL29.1
NetK29_2: K29.2 RL29.2
NetK30_1: K30.1 RL30.1
NetK30_2: K30.2 RL30.2
NetK31_1: K31.1 RL31.1
NetK31_2: K31.2 RL31.2
NetK32_1: K32.1 RL32.1
NetK32_2: K32.2 RL32.2
NetK33_1: K33.1 RL33.1
NetK33_2: K33.2 RL33.2
NetK34_1: K34.1 RL34.1
NetK34_2: K34.2 RL34.2
NetK35_1: K35.1 RL35.1
NetK35_2: K35.2 RL35.2
NetK36_1: K36.1 RL36.1
NetK36_2: K36.2 RL36.2
NetK37_1: K37.1 RL37.1
NetK37_2: K37.2 RL37.2
NetK38_1: K38.1 RL38.1
NetK38_2: K38.2 RL38.2
NetK39_1: K39.1 RL39.1
NetK39_2: K39.2 RL39.2
NetK40_1: K40.1 RL40.1
NetK40_2: K40.2 RL40.2
NetLED1_1: LED1.1(A) R1.2
NetLED2_1: LED2.1(A) R2.2
NetLED3_1: LED3.1(A) R3.2
NetLED4_1: LED4.1(A) R4.2
NetLED5_1: LED5.1(A) R5.2
NetLED6_1: LED6.1(A) R6.2
NetLED7_1: LED7.1(A) R7.2
NetLED8_1: LED8.1(A) R8.2
NetLED9_1: LED9.1(A) R9.2
NetLED10_1: LED10.1(A) R10.2
NetLED11_1: LED11.1(A) R11.2
NetLED12_1: LED12.1(A) R12.2
NetLED13_1: LED13.1(A) R13.2
NetLED14_1: LED14.1(A) R14.2
NetLED15_1: LED15.1(A) R15.2
NetLED16_1: LED16.1(A) R16.2
NetLED17_1: LED17.1(A) R17.2
NetLED18_1: LED18.1(A) R18.2
NetLED19_1: LED19.1(A) R19.2
NetLED20_1: LED20.1(A) R20.2
NetLED21_1: LED21.1(A) R21.2
NetLED22_1: LED22.1(A) R22.2
NetLED23_1: LED23.1(A) R23.2
NetLED24_1: LED24.1(A) R24.2
NetLED25_1: LED25.1(A) R25.2
NetLED26_1: LED26.1(A) R26.2
NetLED27_1: LED27.1(A) R27.2
NetLED28_1: LED28.1(A) R28.2
NetLED29_1: LED29.1(A) R29.2
NetLED30_1: LED30.1(A) R30.2
NetLED31_1: LED31.1(A) R31.2
NetLED32_1: LED32.1(A) R32.2
NetLED33_1: LED33.1(A) R33.2
NetLED34_1: LED34.1(A) R34.2
NetLED35_1: LED35.1(A) R35.2
NetLED36_1: LED36.1(A) R36.2
NetLED37_1: LED37.1(A) R37.2
NetLED38_1: LED38.1(A) R38.2
NetLED39_1: LED39.1(A) R39.2
NetLED40_1: LED40.1(A) R40.2

## Library data of the parts
C1 = Cap: Capacitor; Published: 8-Jun-2000; LatestRevisionDate: 17-Jul-2002; LatestRevisionNote: Re-released for DXP Platform.; PackageReference: RAD-0.3; Publisher: Altium Limited
D1-D40 = Diode: Default Diode; Published: 8-Jun-2000; LatestRevisionDate: 17-Jul-2002; LatestRevisionNote: Re-released for DXP Platform.; PackageDocument: Sep-1996; PackageReference: SMC; Publisher: Altium Limited; Code_JEDEC: DO-214-AB
DP2 LED1-LED40 = LED0: Typical INFRARED GaAs LED; Published: 8-Jun-2000; LatestRevisionDate: 08-Jul-2005; LatestRevisionNote: Mech Layer 1 removed.; PackageReference: LED-0; Publisher: Altium Limited
K1-K40 = Relay-SPST: Single-Pole Single-Throw Relay; Published: 24-Mar-1999; LatestRevisionDate: 17-Jul-2002; LatestRevisionNote: Re-released for DXP Platform.; PackageReference: MODULE4; Publisher: Altium Limited
M1 M2 = Header 10X2: Header, 10-Pin, Dual row; LatestRevisionDate: 17-Jul-2002; LatestRevisionNote: Re-released for DXP Platform.; Publisher: Altium Limited
Power RL1-RL40 = Header 2: Header, 2-Pin; LatestRevisionDate: 17-Jul-2002; LatestRevisionNote: Re-released for DXP Platform.; Publisher: Altium Limited
Q19 = 2N3904: NPN General Purpose Amplifier; Published: 8-Jun-2000; LatestRevisionDate: 15-Jan-2003; LatestRevisionNote: PCB Footprint 'BCY-W3/D4.7' replaced; DatasheetDocument: 1997; PackageDocument: Sep-1998; PackageReference: TO-92A; Publisher: Altium Limited; Code_JEDEC: TO-92A; ComponentLink1Description: Manufacturer Link; ComponentLink1URL: http://www.fairchildsemi.com/; ComponentLink2Description: Datasheet; ComponentLink2URL: http://www.fairchildsemi.com/ds/2N%2F2N3904.pdf
R1-R40 Rp2 = Res3: Resistor; Published: 8-Jun-2000; LatestRevisionDate: 04-Mar-2005; LatestRevisionNote: PCB Footprint replaced.; PackageReference: J1-0603; Publisher: Altium Limited